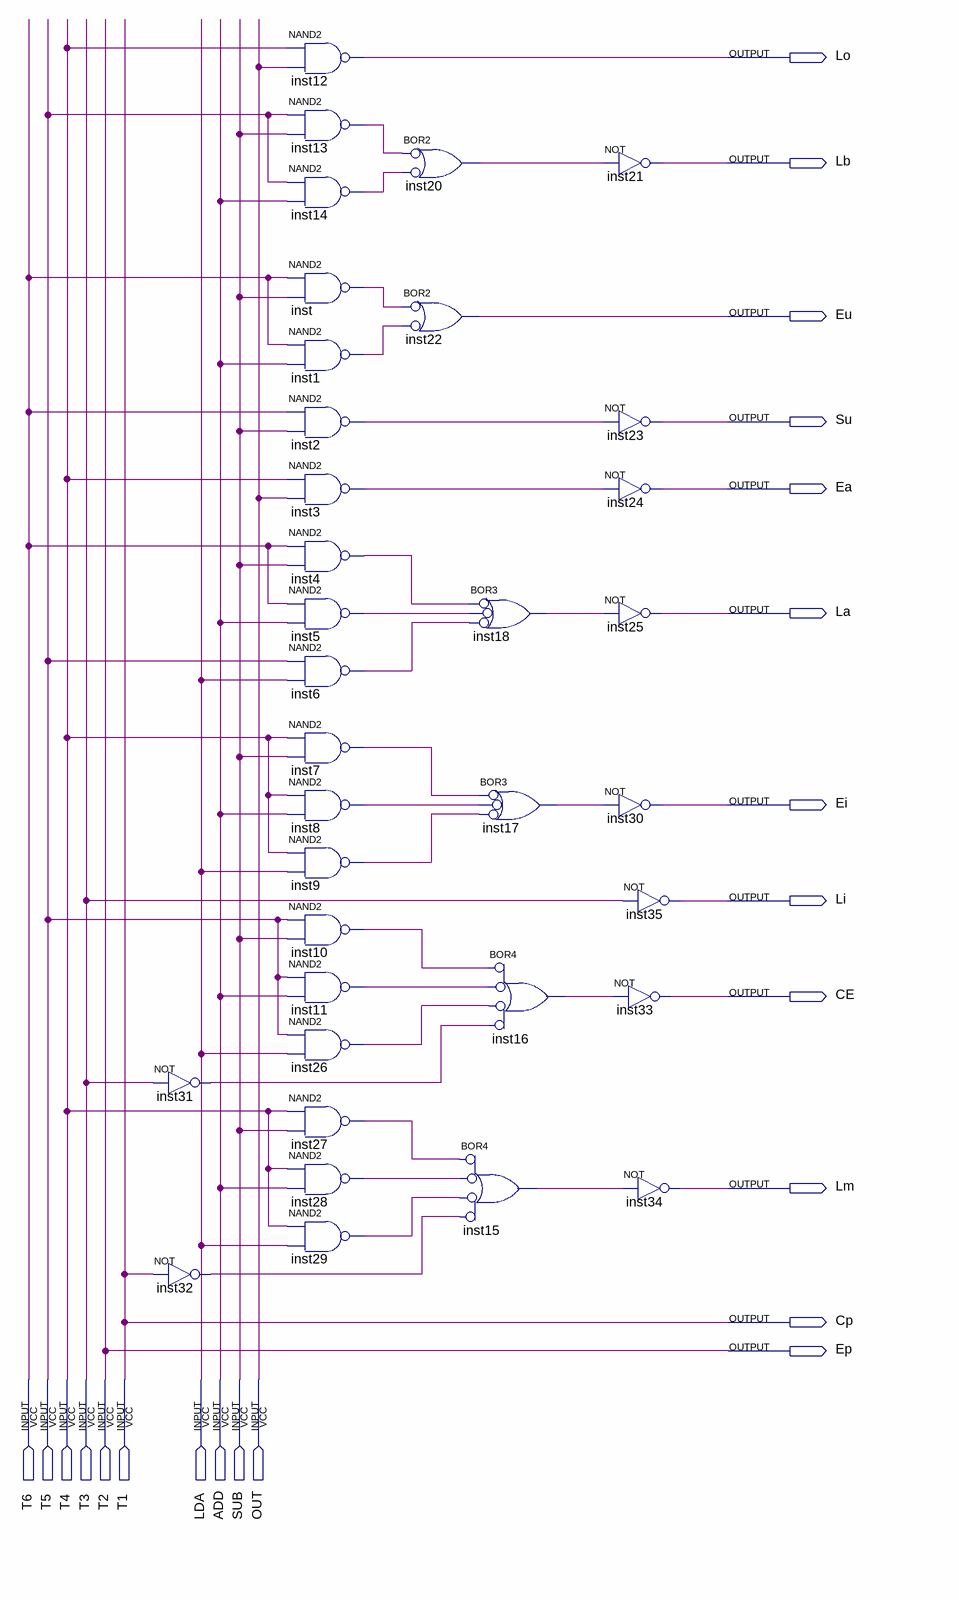
[diagram p0: schematic sheet]
// Quartus schematic Control_Matrix.bdf as structural Verilog: 35 symbols, 22 pins
module Control_Matrix (
  input  T6,
  input  T5,
  input  T4,
  input  T3,
  input  T2,
  input  T1,
  input  LDA,
  input  ADD,
  input  SUB,
  input  OUT,
  output Lo,
  output Lb,
  output Eu,
  output Su,
  output Ea,
  output La,
  output Ei,
  output Li,
  output CE,
  output Lm,
  output Cp,
  output Ep
);

  wire inst1_out, inst2_out, inst3_out, inst4_out, inst5_out, inst6_out, inst7_out, inst8_out, inst9_out,
       inst10_out, inst11_out, inst13_out, inst14_out, inst15_out, inst16_out, inst17_out, inst18_out,
       inst20_out, inst26_out, inst27_out, inst28_out, inst29_out, inst31_out, inst32_out, inst_out;

  not inst31 (inst31_out, T3);
  not inst32 (inst32_out, T1);
  nand inst12 (Lo, T4, OUT);
  nand inst13 (inst13_out, T5, SUB);
  nand inst14 (inst14_out, T5, ADD);
  nand inst (inst_out, T6, SUB);
  nand inst1 (inst1_out, T6, ADD);
  nand inst2 (inst2_out, T6, SUB);
  nand inst3 (inst3_out, T4, OUT);
  nand inst4 (inst4_out, T6, SUB);
  nand inst5 (inst5_out, T6, ADD);
  nand inst6 (inst6_out, T5, LDA);
  nand inst7 (inst7_out, T4, SUB);
  nand inst8 (inst8_out, T4, ADD);
  nand inst9 (inst9_out, T4, LDA);
  nand inst10 (inst10_out, T5, SUB);
  nand inst11 (inst11_out, T5, ADD);
  nand inst26 (inst26_out, T5, LDA);
  nand inst27 (inst27_out, T4, SUB);
  nand inst28 (inst28_out, T4, ADD);
  nand inst29 (inst29_out, T4, LDA);
  or inst20 (inst20_out, ~inst13_out, ~inst14_out);  // BOR2
  or inst22 (Eu, ~inst_out, ~inst1_out);  // BOR2
  or inst18 (inst18_out, ~inst4_out, ~inst5_out, ~inst6_out);  // BOR3
  or inst17 (inst17_out, ~inst7_out, ~inst8_out, ~inst9_out);  // BOR3
  or inst15 (inst15_out, ~inst27_out, ~inst28_out, ~inst29_out, ~inst32_out);  // BOR4
  or inst16 (inst16_out, ~inst10_out, ~inst11_out, ~inst26_out, ~inst31_out);  // BOR4
  not inst21 (Lb, inst20_out);
  not inst23 (Su, inst2_out);
  not inst24 (Ea, inst3_out);
  not inst25 (La, inst18_out);
  not inst30 (Ei, inst17_out);
  not inst35 (Li, T3);
  not inst33 (CE, inst16_out);
  not inst34 (Lm, inst15_out);

  assign Cp = T1;
  assign Ep = T2;
endmodule
